# Altium schematic sheet Step-up DC-DC Converter.SchDoc
size A; SheetNumber: 2; SheetTotal: 2
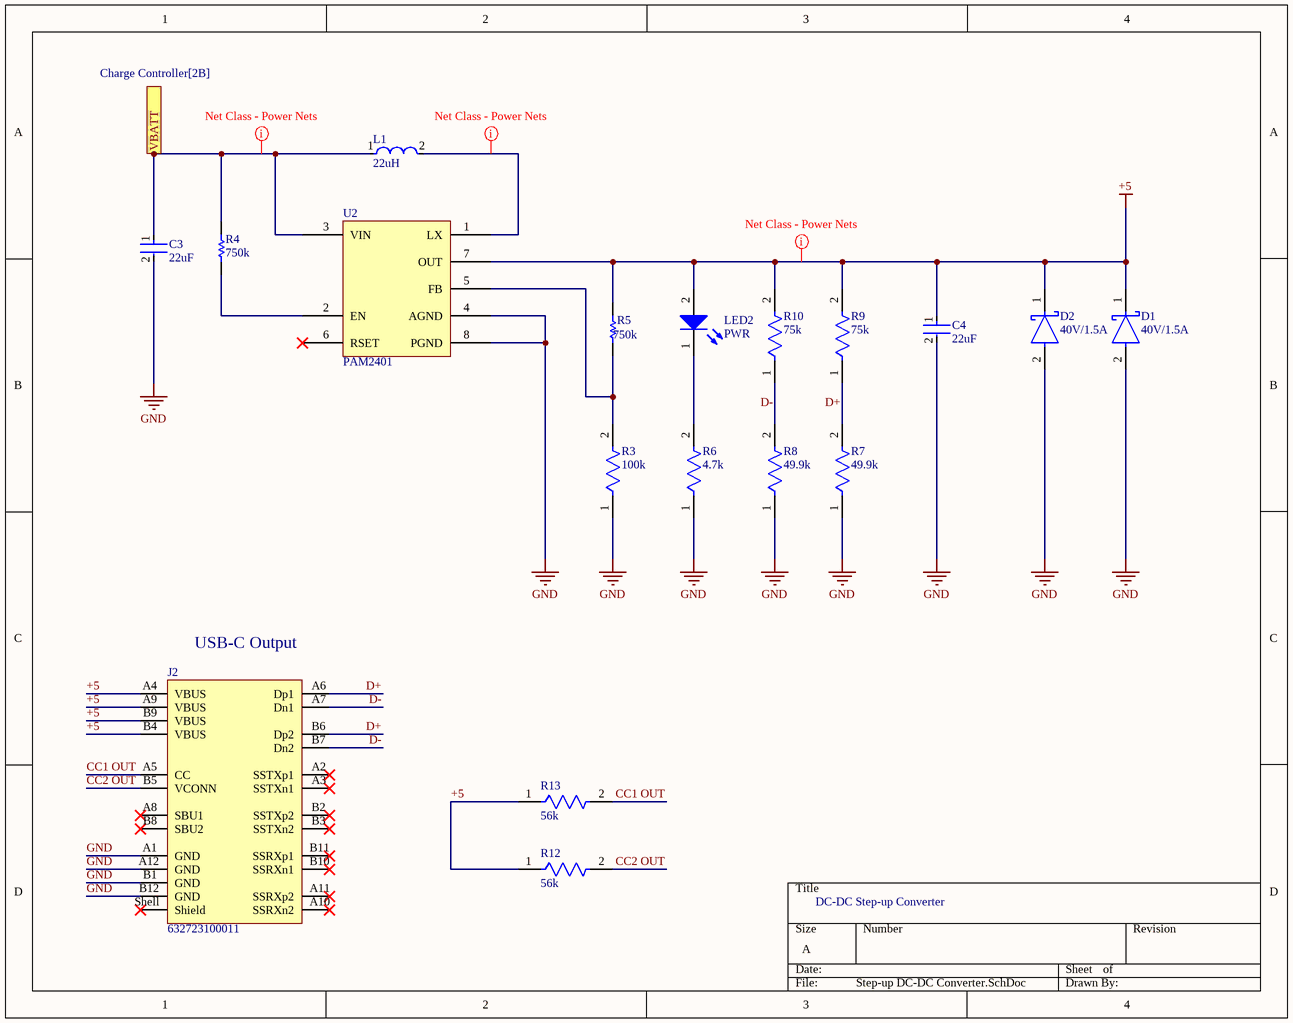
[diagram p0: Step-up DC-DC Converter.SchDoc]

## Parts
C3  22uF  [FP-GRM21B-0_15-MFG]
C4  22uF  [FP-GRM21B-0_15-MFG]
D1  40V/1.5A  [FP-95400-MFG]
D2  40V/1.5A  [FP-95400-MFG]
J2  632723100011  [632723100011]
L1  22uH  [FP-LQM2HPN_G0-IPC_C]
LED2  PWR  [WL-SMCW_0805_150080xx75000]
R3  100k  [FP-CRCW0805-e3-MFG]
R4  750k  [RESC2013X50X30LL20T20]
R5  750k  [RESC2013X50X30LL20T20]
R6  4.7k  [FP-CRCW0805-e3-IPC_B]
R7  49.9k  [FP-CRCW0805-e3-IPC_C]
R8  49.9k  [FP-CRCW0805-e3-IPC_C]
R9  75k  [FP-CRCW0805-e3-IPC_A]
R10  75k  [FP-CRCW0805-e3-IPC_A]
R12  56k  [FP-CRCW0805-e3-IPC_B]
R13  56k  [FP-CRCW0805-e3-IPC_B]
U2  PAM2401  [TSOP65P490X110-8N]

## Ports
VBATT (see Charge Controller[2B])

## Nets
+5: C4.1 D1.1(C) D2.1(C) J2.A4(VBUS) J2.A9(VBUS) J2.B4(VBUS) J2.B9(VBUS) LED2.2(A) R5.2 R9.2 R10.2 R12.1 R13.1 U2.7(OUT)
GND: C3.2 C4.2 D1.2(A) D2.2(A) J2.A1(GND) J2.A12(GND) J2.B1(GND) J2.B12(GND) R3.1 R6.1 R7.1 R8.1 U2.4(AGND) U2.8(PGND)
CC1 OUT: J2.A5(CC) R13.2
CC2 OUT: J2.B5(VCONN) R12.2
D+: J2.A6(Dp1) J2.B6(Dp2) R7.2 R9.1
D-: J2.A7(Dn1) J2.B7(Dn2) R8.2 R10.1
VBATT: C3.1 L1.1 R4.2 U2.3(VIN) ; port VBATT
NetL1_2: L1.2 U2.1(LX)
NetLED2_1: LED2.1(K) R6.2
NetR3_2: R3.2 R5.1 U2.5(FB)
NetR4_1: R4.1 U2.2(EN)

Not connected (* = marked no-connect by the designer): J2 A2(SSTXp1)* A3(SSTXn1)* A8(SBU1)* A10(SSRXn2)* A11(SSRXp2)* B2(SSTXp2)* B3(SSTXn2)* B8(SBU2)* B10(SSRXn1)* B11(SSRXp1)* Shell(Shield)*; U2 6(RSET)*

## Layout directives
net class PowerNets: +5, NetL1_2, VBATT

## Notes on the sheet
- (near J2) USB-C Output
- DC-DC Step-up Converter

## Library data of the parts
C3 C4 = CMP-2007-03385-2: Chip Multilayer Ceramic Capacitors for General Purpose, 0805, 22uF, X5R, 15%, 20%, 6.3V; Material: Ceramic; Max Operating Temperature: 85°C; Voltage: 6.3V; Min Operating Temperature: -55°C; Case/Package: 0805; Thickness: 0.053inch; Dielectric: X5R; Packaging: Tape and Reel; Depth: 1.25mm; Termination: SMD/SMT; Voltage Rating (DC): 6.3V; Radiation Hardening: No; Tolerance: 20%; Mount: Surface Mount; Lead Free: Lead Free; Package Quantity: 1; REACH SVHC: No SVHC; Voltage Rating: 6.3V; Capacitance: 22uF; Length: 2mm; Case Code (Imperial): 0805; Case Code (Metric): 2012; Width: 0.049inch; Height: 1.25mm
D1 D2 = CMP-02539-000025-1: DIODE SCHOTTKY 40V 1.5A SMA; Manufacturer: Vishay; Manufacturer Part Number: VS-15MQ040NTRPBF; Standoff Height: 0mm; Capacitance: 134pF; Peak Reverse Current: 0.5mA; Max Junction Temp: +150°C; Value: 134pF; Max Surge Forward Current: 140A; RoHS: TRUE; Lead Free: Yes; Octopart: https://octopart.com/vs-15mq040ntrpbf-vishay-44340959; Max Repetitive Reverse Voltage: 40V; Device Class L1: Discrete Semiconductors; ComponentLink2URL: http://www.vishay.com/docs/94141/vs-15mq040ntrpbf.pdf; Reverse Voltage: 40V; ComponentLink2Description: Datasheet; Forward Current: 1.5A; Temperature: -40°C to +150°C; Digikey Description: DIODE SCHOTTKY 40V 1.5A SMA; Height: 2.29mm; Category: Diode; Footprint Url: http://www.vishay.com/docs/95400/sma.pdf; Device Class L2: Diodes; Device Class L3: Schottky Diodes; Mouser Description: Schottky Diodes & Rectifiers 2.1 Amp 40 Volt; Automotive: No; Package: 95400; Temperature Range Low: -40°C; Temperature Range High: +150°C
J2 = CMP-1502-03213-3: NexarPartId: 68112674; Voltage Rating: 20V; Gender: Receptacle; Current Rating: 5A; Pin Length: 1.5mm; Contact Resistance: 30mΩ; Connector Type: USB; USB Standard: USB 3.1; Insulation Resistance: 1GΩ; Number of Contacts: 24; Contact Material: Gold, Nickel; Max Operating Temperature: 105°C; Packaging: Tape and Reel; Height: 3.16mm; RoHS: Compliant; Orientation: Horizontal; Mount: Surface Mount, Through Hole; Number of Pins: 24; Min Operating Temperature: -40°C
L1 = CMP-06042-017002-1: Multilayer Type Inductor for Power Lines, 1008 (2520), 2.2μH, 20%, 0.225Ω, 1100mA; Current Rating: 1.1A; Test Frequency: 1MHz; Inductance: 2.2uH; Self Resonant Frequency: 40MHz; Shielding: Shielded; DC Resistance (DCR): 225mR; Length: 0.098inch; Package Quantity: 3000; Height - Seated (Max): 0.039inch; Packaging: Tape and Reel; Width: 0.079inch; Max Operating Temperature: 85°C; Tolerance: 20%; RoHS Compliant: Yes; Case/Package: 1008; Min Operating Temperature: -40°C; Mount: Surface Mount
LED2 = CMP-1426-00008-7: Led, Blue, 470 Nm, 3.2 V, 30 Ma, 145 Mcd Rohs Compliant: Yes; Dominant Wavelength: 470nm; Max Junction Temperature (Tj): 95°C; Power Dissipation: 105mW; Peak Wavelength: 465nm; Max Reverse Voltage (DC): 5V; Forward Current: 100mA; Test Current: 20mA; Luminous Intensity: 145mcd; Lens Style: Clear, Rectangular; Viewing Angle: 140°; Forward Voltage: 3.2V; Color: Blue; Height: 700µm; Case Code (Imperial): 0805; Width: 1.25mm; REACH SVHC: Unknown; Case/Package: 0805; Lead Free: Lead Free; Mount: Surface Mount; Packaging: Tape and Reel; RoHS: Compliant; Reverse Voltage: 5V; Min Operating Temperature: -40°C; Case Code (Metric): 2012; Wavelength: 470nm; Max Operating Temperature: 85°C; Length: 2mm
R3 = CMP-2001-04899-2: RES Thick Film, 100kΩ, 1%, 0.125W, 100ppm/°C, 0805; Resistance: 100kR; Power Rating: 125mW; Voltage Rating: 150V; Case/Package: 0805; Max Operating Temperature: 155°C; Case Code (Imperial): 0805; Lead Free: Lead Free; Weight: 0.000194oz; Number of Pins: 2; Package Quantity: 5000; Height: 0.45mm; Composition: Thick Film; Military Standard: Not; Tolerance: 1%; Case Code (Metric): 2012; Termination: SMD/SMT; Mount: Surface Mount; Radiation Hardening: No; Width: 1.25mm; Length: 2mm; Depth: 1.25mm; Packaging: Tape and Reel; Min Operating Temperature: -55°C; Contact Plating: Tin; Temperature Coefficient: 100ppm/°C; Voltage Rating (DC): 150V
R4 R5 = CMP-2001-04102-1: Manufacturer: Vishay Dale; Part Number: CRCW0805750KFKEA
R6 = CMP-2100-03615-2: RES Thick Film, 4.7kΩ, 1%, 0.125W, 100ppm/°C, 0805; Max Power Dissipation: 125mW; Resistance: 4.7kR; Voltage Rating: 150V; Termination: SMD/SMT; Weight: 0.000194oz; Case/Package: 0805; Number of Terminations: 2; Min Operating Temperature: -55°C; Case Code (Metric): 2012; Package Quantity: 10; Depth: 1.25mm; Military Standard: Not; Composition: Thick Film; Radiation Hardening: No; Contact Plating: Tin; Height: 0.45mm; Power Rating: 125mW; Features: Automotive AEC-Q200; Tolerance: 1%; Packaging: Tape and Reel; Max Operating Temperature: 155°C; Length: 2mm; Case Code (Imperial): 0805; Voltage Rating (DC): 150V; Width: 1.25mm; Temperature Coefficient: 100ppm/°C; Lead Free: Lead Free
R7 R8 = CMP-2001-03952-2: RES Thick Film, 49.9kΩ, 1%, 0.125W, 100ppm/°C, 0805; Resistance: 49.9kR; Power Rating: 125mW; Voltage Rating (DC): 150V; Contact Plating: Tin; Case Code (Imperial): 0805; Package Quantity: 10; Termination: SMD/SMT; Length: 2mm; Width: 0.049inch; Case Code (Metric): 2012; Temperature Coefficient: 100ppm/°C; Tolerance: 1%; Depth: 1.25mm; Mount: Surface Mount; Lead Free: Lead Free; Min Operating Temperature: -55°C; Case/Package: 0805; Number of Terminations: 2; Composition: Thick Film; Height: 0.45mm; Voltage Rating: 150V; Max Power Dissipation: 125mW; Features: Automotive AEC-Q200; Military Standard: Not; Radiation Hardening: No; Max Operating Temperature: 155°C; Weight: 0.000194oz; Packaging: Tape and Reel
R9 R10 = CMP-2001-04106-2: RES Thick Film, 75kΩ, 1%, 0.125W, 100ppm/°C, 0805; Voltage Rating: 150V; Power Rating: 125mW; Resistance: 75kR; Series: CRCW; Packaging: Tape and Reel; Width: 0.049inch; Package Quantity: 10; Max Operating Temperature: 155°C; Height: 0.45mm; Temperature Coefficient: 100ppm/°C; Resistor Type: Thick Film; Case Code (Metric): 2012; RoHS Compliant: Yes; Military Standard: Not; Weight: 0.000194oz; Mount: Surface Mount; Depth: 1.25mm; Max Power Dissipation: 125mW; Tolerance: 1%; Lead Free: Lead Free; Working Voltage: 150V; Technology: THICK FILM; Radiation Hardening: No; Termination: SMD/SMT; Number of Terminations: 2; Number of Pins: 2; Features: Automotive AEC-Q200; Case Code (Imperial): 0805; Resistance Tolerance: 1%; Min Operating Temperature: -55°C; Voltage Rating (DC): 150V; Contact Plating: Tin; Case/Package: 0805; Construction: Rectangular; Length: 2mm
R12 R13 = CMP-2001-04015-2: RES Thick Film, 56kΩ, 1%, 0.125W, 100ppm/°C, 0805; Resistance: 56kR; Power Rating: 125mW; Voltage Rating: 150V; Depth: 1.25mm; Contact Plating: Tin; Package Quantity: 10; Min Operating Temperature: -55°C; Case/Package: 0805; Packaging: Tape and Reel; Lead Free: Lead Free; Case Code (Imperial): 0805; Tolerance: 1%; Height: 0.45mm; Max Operating Temperature: 155°C; Case Code (Metric): 2012; Number of Pins: 2; Width: 1.25mm; Mount: Surface Mount; Voltage Rating (DC): 150V; Max Power Dissipation: 125mW; Weight: 0.000194oz; Termination: SMD/SMT; Length: 2mm; Radiation Hardening: No; Composition: Thick Film; Features: Automotive AEC-Q200; Number of Terminations: 2; Temperature Coefficient: 100ppm/°C; Military Standard: Not
U2 = PAM2401: 1.0MHz STEP-UP DC-DC CONVERTER